# Altium project buckboost.PrjPCB
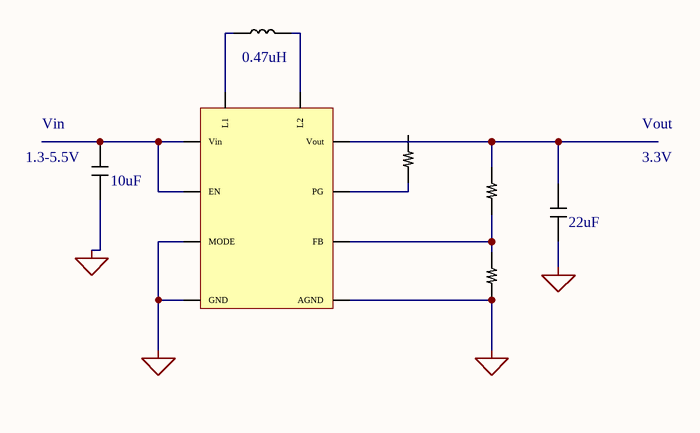
[diagram p0: buckboost.SchDoc]
1 sheet, 7 parts. Net scope: global (net labels, ports and power ports of the same name join across sheets).
Board file: buckboost.PcbDoc

## Sheet buckboost.SchDoc
size B

### Parts
C1  10uF  [cap]
C2  22uF  [cap]
L  0.47uH  [coil]
r1  resistor  [resistor]  (value not drawn)
R2  resistor  [resistor]  (value not drawn)
R3  resistor  [resistor]  (value not drawn)
TPS63802  TPS63802  [TPS63802]  (value not drawn)

### Nets
GND: C1.2 C2.1 R3.1 TPS63802.2(MODE) TPS63802.3(AGND) TPS63802.8(GND)
NetC1_1: C1.1 TPS63802.1(EN) TPS63802.10(Vin)
NetC2_2: C2.2 R2.1 TPS63802.6(Vout)
NetL_1: L.1 TPS63802.9(L1)
NetL_2: L.2 TPS63802.7(L2)
Netr1_1: r1.1 TPS63802.5(PG)
NetR2_2: R2.2 R3.2 TPS63802.4(FB)

Not connected (* = marked no-connect by the designer): r1 2

### Notes on the sheet
- (near C1) 1.3-5.5V
- (near C1) Vin
- Vout
- 3.3V

### Library data of the parts
C1 C2 = cap
L = coil